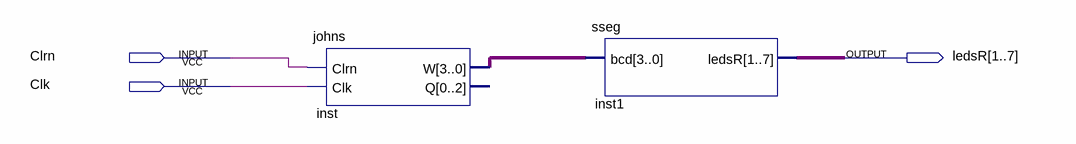
[diagram p0: schematic sheet]
// Quartus schematic final.bdf as structural Verilog: 2 symbols, 3 pins
module \final  (
  input  Clrn,
  input  Clk,
  output [1:7] ledsR
);

  wire [3:0] inst_w;

  johns inst (.Clrn(Clrn), .Clk(Clk), .W(inst_w));  // open: Q
  sseg inst1 (.bcd(inst_w), .ledsR(ledsR));
endmodule
